# Altium schematic sheet Atmega328PB.SchDoc
size 420 x 297 mm; Author: Denizhan ALTAY; SheetNumber: 6; SheetTotal: 5
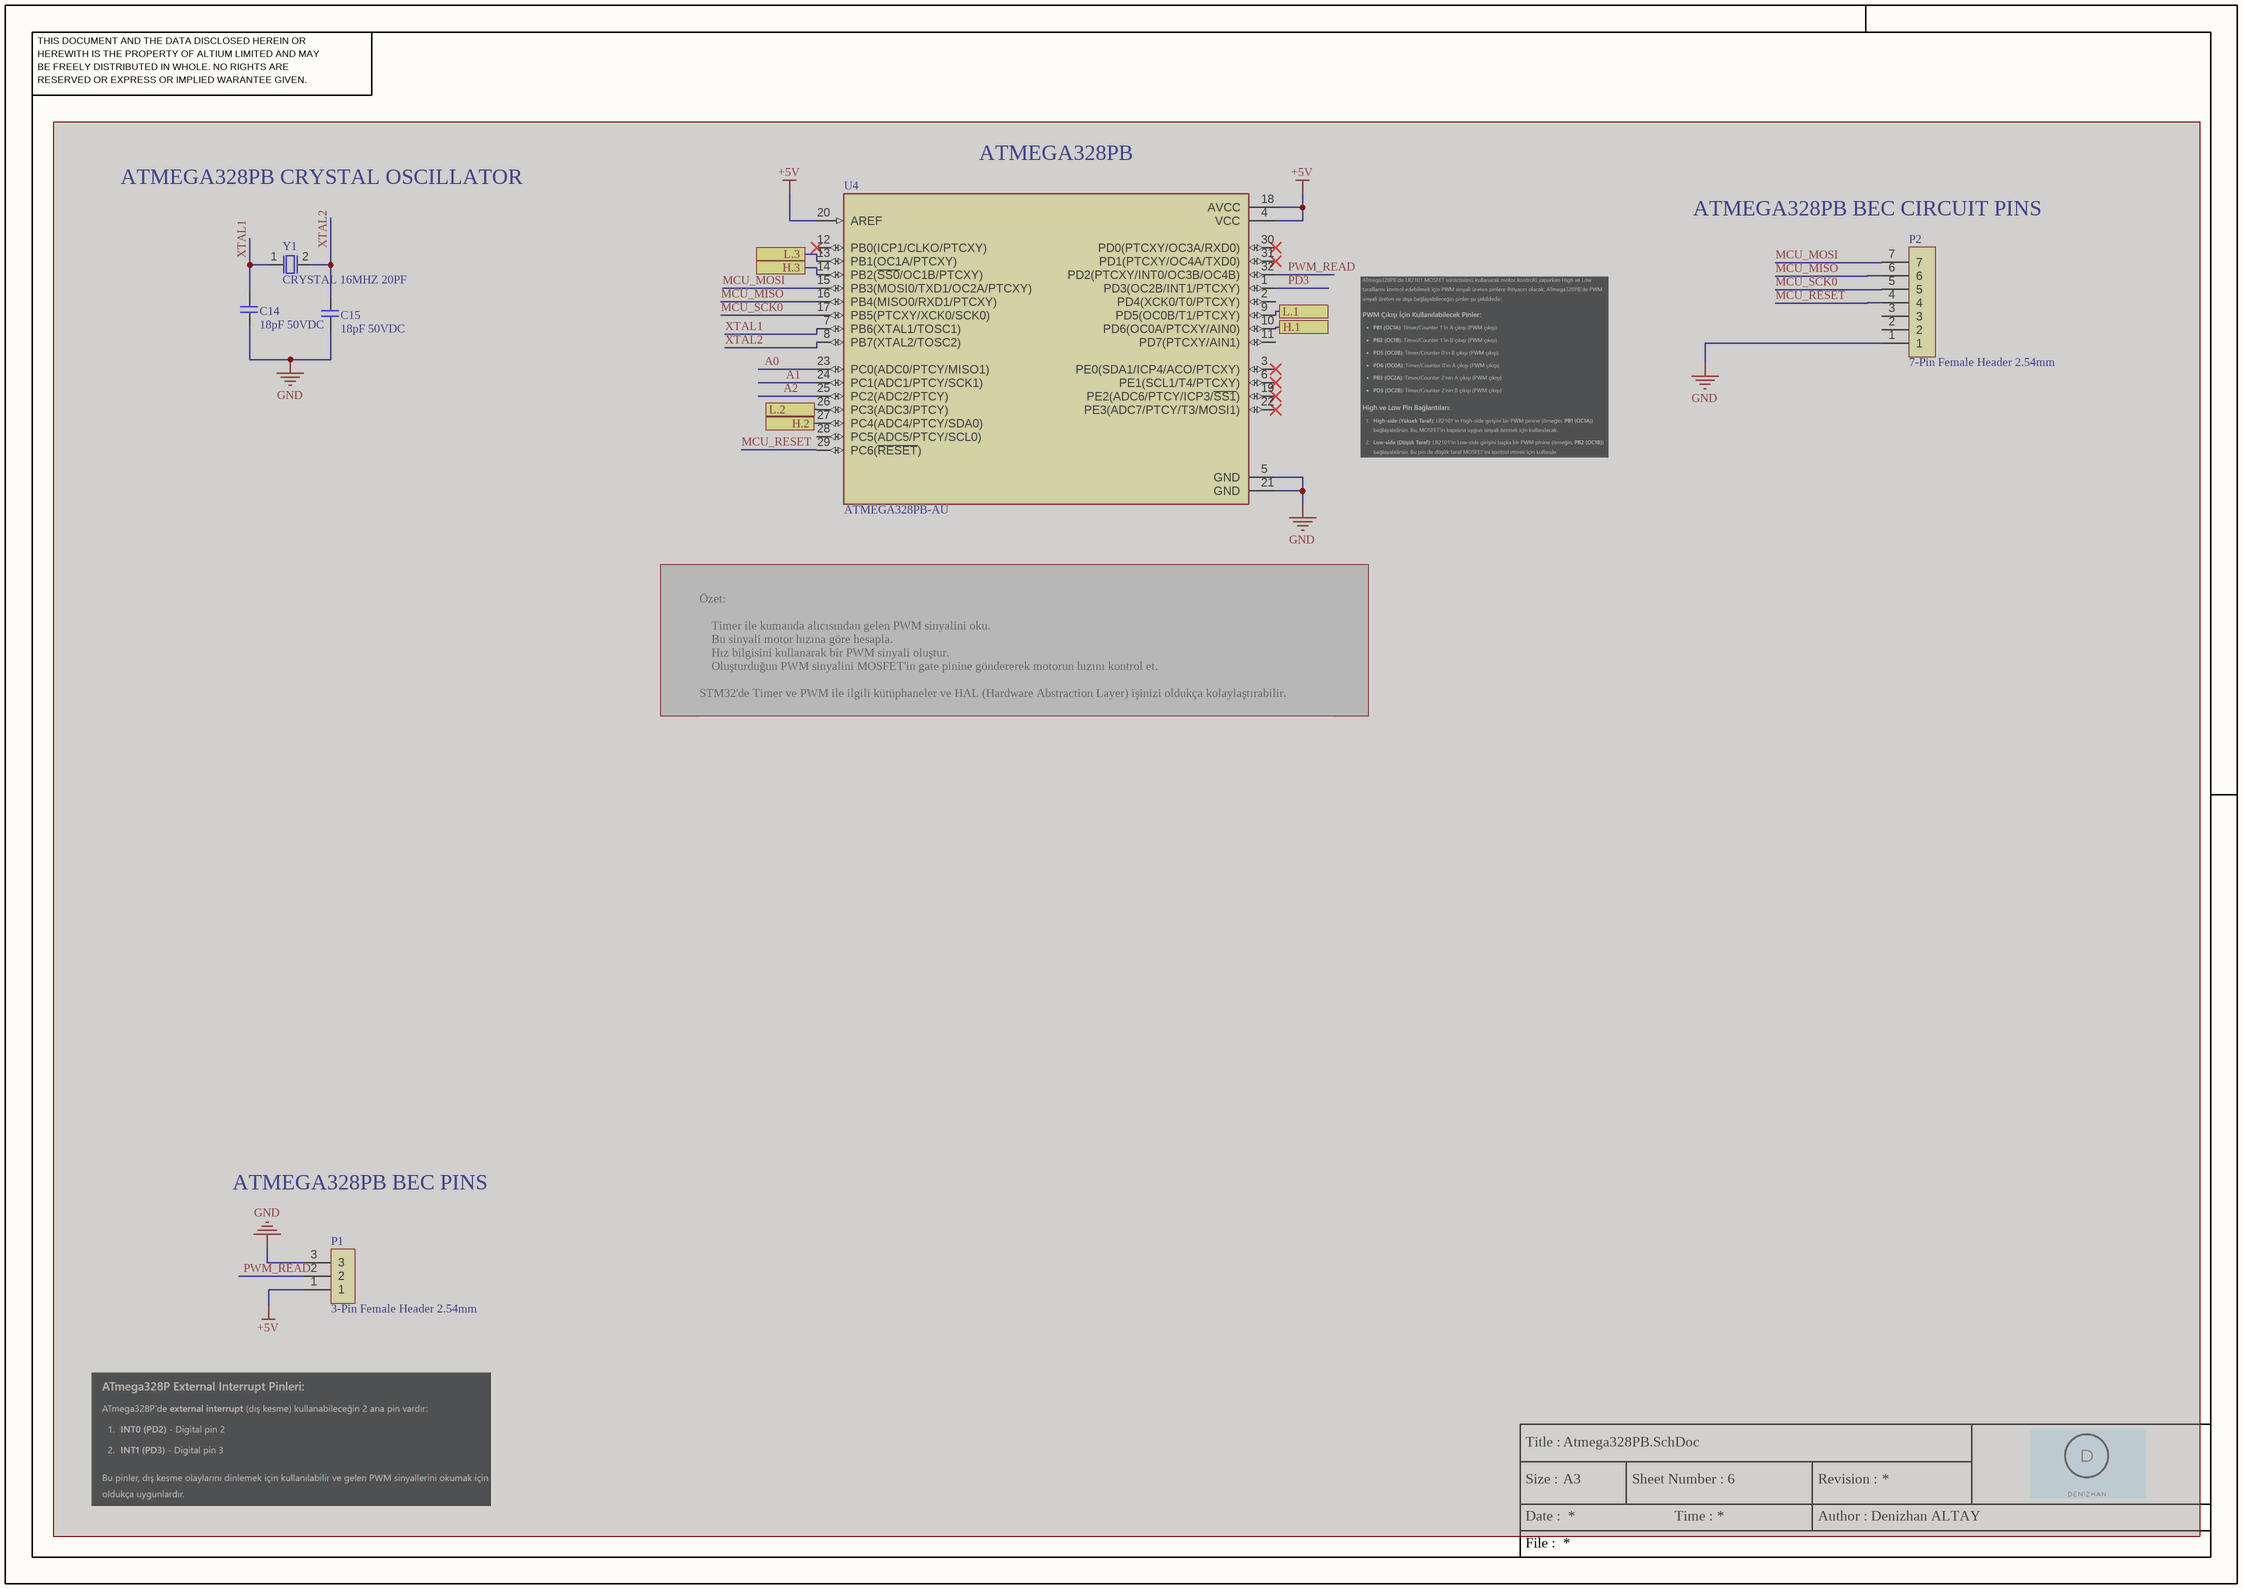
[diagram p0: Atmega328PB.SchDoc]

## Parts
C14  18pF 50VDC  [0603_UNP_Cap]  (masked out: inside a compile mask, not in the netlist)
C15  18pF 50VDC  [0603_UNP_Cap]  (masked out: inside a compile mask, not in the netlist)
P1  3-Pin Female Header 2.54mm  [1x3 Pin Female Header 2.54mm]  (masked out: inside a compile mask, not in the netlist)
P2  7-Pin Female Header 2.54mm  [Single 7-Pin (2.54mm) Female Header]  (masked out: inside a compile mask, not in the netlist)
U4  ATMEGA328PB-AU  [ATMEGA328PB-AU]  (masked out: inside a compile mask, not in the netlist)
Y1  CRYSTAL 16MHZ 20PF  [16MHZ_CrsytalOscillator]  (masked out: inside a compile mask, not in the netlist)

## Ports
H.1 (see MosfetDrivers[1B]), H.2 (see MosfetDrivers[1C]), H.3 (see MosfetDrivers[3B]), L.1 (see MosfetDrivers[1B]), L.2 (see MosfetDrivers[1C]), L.3 (see MosfetDrivers[3B])

## Notes on the sheet
- ATMEGA328PB CRYSTAL OSCILLATOR
- (near U4) ATMEGA328PB
- (near P2) ATMEGA328PB BEC CIRCUIT PINS
- Özet:
  Timer ile kumanda alıcısından gelen PWM sinyalini oku.
  Bu sinyali motor hızına göre hesapla.
  Hız bilgisini kullanarak bir PWM sinyali oluştur.
  Oluşturduğun PWM sinyalini MOSFET'in gate pinine göndererek motorun hızını kontrol et.
  STM32'de Timer ve PWM ile ilgili kütüphaneler ve HAL (Hardware Abstraction Layer) işinizi oldukça kolaylaştırabilir.
- ATMEGA328PB BEC PINS
- THIS DOCUMENT AND THE DATA DISCLOSED HEREIN OR
- HEREWITH IS THE PROPERTY OF ALTIUM LIMITED AND MAY
- BE FREELY DISTRIBUTED IN WHOLE. NO RIGHTS ARE
- RESERVED OR EXPRESS OR IMPLIED WARANTEE GIVEN.
- Title :
- Size :
- Date :
- A3
- Sheet Number :
- Time :
- Revision :
- Author :
- File :

## Library data of the parts
C14 C15 = MCF03JTN500180 - MLCC 0603 18pF 50VDC ±5% C0G (NP0): MCF03JTN500180 - MLCC (1608) 0603 18pF 50VDC ±5% C0G (NP0); Manufacturer: VIKING; Part Number: MCF03MTX250106; Capacitor Type: Ceramic; Library Ref: Capacitors; Package / Case: 0603; Capacitor Value: 18pF; ComponentLink1Description: New link; ComponentLink1URL: https://www.ozdisan.com/passive-components/resistors/smt-smd-and-chip-resistors/PS03W4F1003T5E/592727; Max Working Voltage: 50VDC
P1 = Single 3-Pin (2.54mm) Female Header: Library Ref: Header
P2 = Single 7-Pin (2.54mm) Female Header: Library Ref: Header
U4 = ATMEGA328PB-AU: ATmega Series 20 MHz 32 KB Flash 2 KB SRAM 8-Bit Microcontroller - TQFP-32; MF: {'manufacturer': u'Microchip Technology'}; Price: None; Availability: Unavailable; Package / Case: SMD; Library Ref: Microprocessors; Name: ATMEGA328PB-AU
Y1 = AS-16.000-20-SMD-TR - CRYSTAL 16.0000MHZ 20PF SMD: Button Size: 12mm; Library Ref: Oscillator; Package / Case: SMD; Oscillator Type: Crystal; Part Number: AS-16.000-20-SMD-TR